# EAGLE design solderpractice (EAGLE 9.6.2)
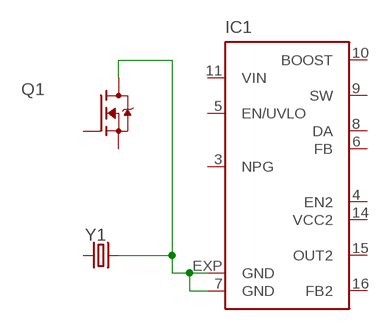
[diagram p0: schematic, sheet 1]

## Parts
IC1  LT3645EUD  [QFN3X3-6]
Q1  POWERPAK-SO8-N-MOSFET  [POWERPAK-SO8]
Y1  XRCGB-CRYSTAL  [XRCGB]

## Nets
GND: IC1.7(GND) IC1.EXP(GND) Q1.5-8(D) Y1.3
Unconnected: IC1.3(NPG) IC1.4(EN2) IC1.5(EN/UVLO) IC1.6(FB) IC1.8(DA) IC1.9(SW) IC1.10(BOOST) IC1.11(VIN) IC1.14(VCC2) IC1.15(OUT2) IC1.16(FB2) Q1.1(S) Q1.2(S) Q1.3(S) Q1.4(G) Y1.1

## Library data of the parts
IC1 = linear-technology:LT3645: 36V 500mA Step-Down Regulator and 200mA LDO Source: http://cds.linear.com/docs/en/datasheet/3645f.pdf
Q1 = BW-Active:POWERPAK-SO8-N-MOSFET
Y1 = BW-PassiveMechanical:XRCGB-CRYSTAL

## Board
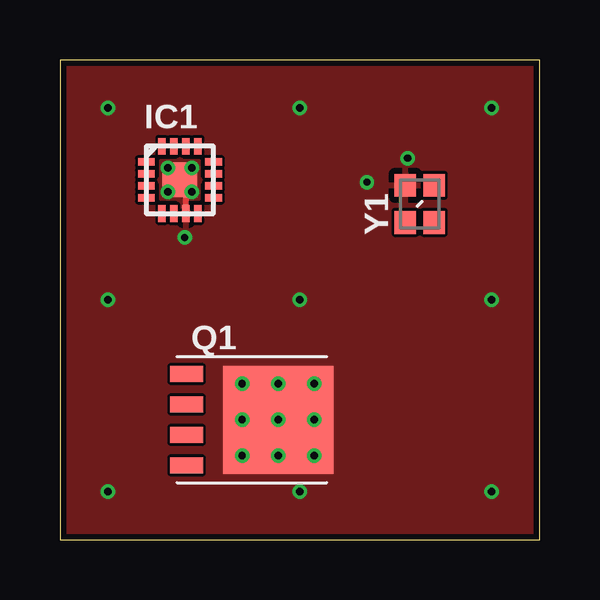
[diagram p1: board, top side]
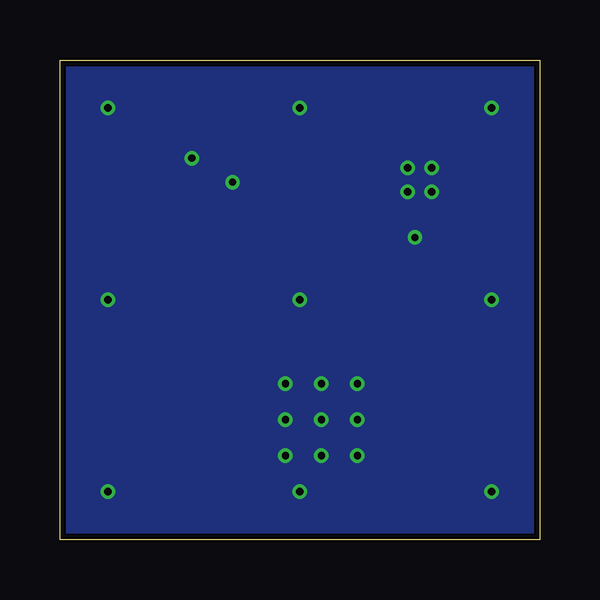
[diagram p2: board, bottom side, seen from below]

Size 20 x 20 mm. Coordinates in mm from the lower left corner, seen from the top.
Outline: 0,0 20,0 20,20 0,20 0,0
Copper layers (1*16): Top 0.035mm / dielectric 1.53mm / Bottom 0.035mm
Design rules "jlcpcb-2l": minimum track width 5mil, minimum drill 0.3mm, track to track 5mil, track to pad 5mil, pad to pad 5mil, via to via 5mil, smd to smd 0mil, copper to edge 0.25mm, drill to drill 0.5mm, minimum pad ring 0.15mm, minimum via ring 0.15mm, stop-mask expansion 4mil, vias tented up to drill 0.3mm, thermal gap 10mil

### Footprints (pad centres in the part's own frame; a part is rotated, then mirrored left to right if it is on the bottom)
QFN3X3-6 = smd 0.7 x 0.3: 1 -1.4,0.75; 2 -1.4,0.25; 3 -1.4,-0.25; 4 -1.4,-0.75; 9 1.4,-0.75; 10 1.4,-0.25; 11 1.4,0.25; 12 1.4,0.75 | smd 0.3 x 0.7: 5 -0.75,-1.4; 6 -0.25,-1.4; 7 0.25,-1.4; 8 0.75,-1.4; 13 0.75,1.4; 14 0.25,1.4; 15 -0.25,1.4; 16 -0.75,1.4 | smd 1.45 x 1.45: EXP 0,0
POWERPAK-SO8 = smd 1.37 x 0.65: 1 -2.72,1.905; 2 -2.72,0.635; 3 -2.72,-0.635; 4 -2.72,-1.905 | smd 4.6 x 4.5: 5-8 1.105,0
XRCGB = smd 0.95 x 0.9: 1 -0.775,-0.6; 2 0.775,-0.6; 3 0.775,0.6; 4 -0.775,0.6

### Placement (x,y rotation side)
IC1  5,15 0 top
Q1  8,5 0 top
Y1  15,14 90 top

### Tracks (layer width: path | path; a pad name or v marks a point on that pad's centre or on a via)
GND  (via drill 0.3)
  Top 0.254: IC1.7 5.25,14.25 v5.5,14.5
  other vias: 2,18 10,18 18,18 18,10 10,10 2,10 2,2 10,2 18,2 7.6,6.5 10.6,6.5 10.6,3.5 7.6,3.5 9.1,3.5 7.6,5 9.1,6.5 10.6,5 9.1,5 12.8,14.9 14.5,15.9 4.5,15.5 5.5,15.5 4.5,14.5 5.2,12.6
  pour Top: -1,21 21,21 21,-1 -1,-1
  pour Top (no thermals): 4.2,15.8 4.2,14.2 5.8,14.2 5.8,15.8
  pour Top (no thermals): 6.4,7.7 11.9,7.7 11.9,2.3 6.4,2.3
  pour Bottom: -1,21 -1,-1 21,-1 21,21